# EasyEDA schematic Percepção_Térmica.json
TITLE: Potentiometer controller circuit; REV: 1.0; Date: 2020-03-27; Sheet: 1/1; Drawn By: bruna_eletronjun; Company: EletronJun
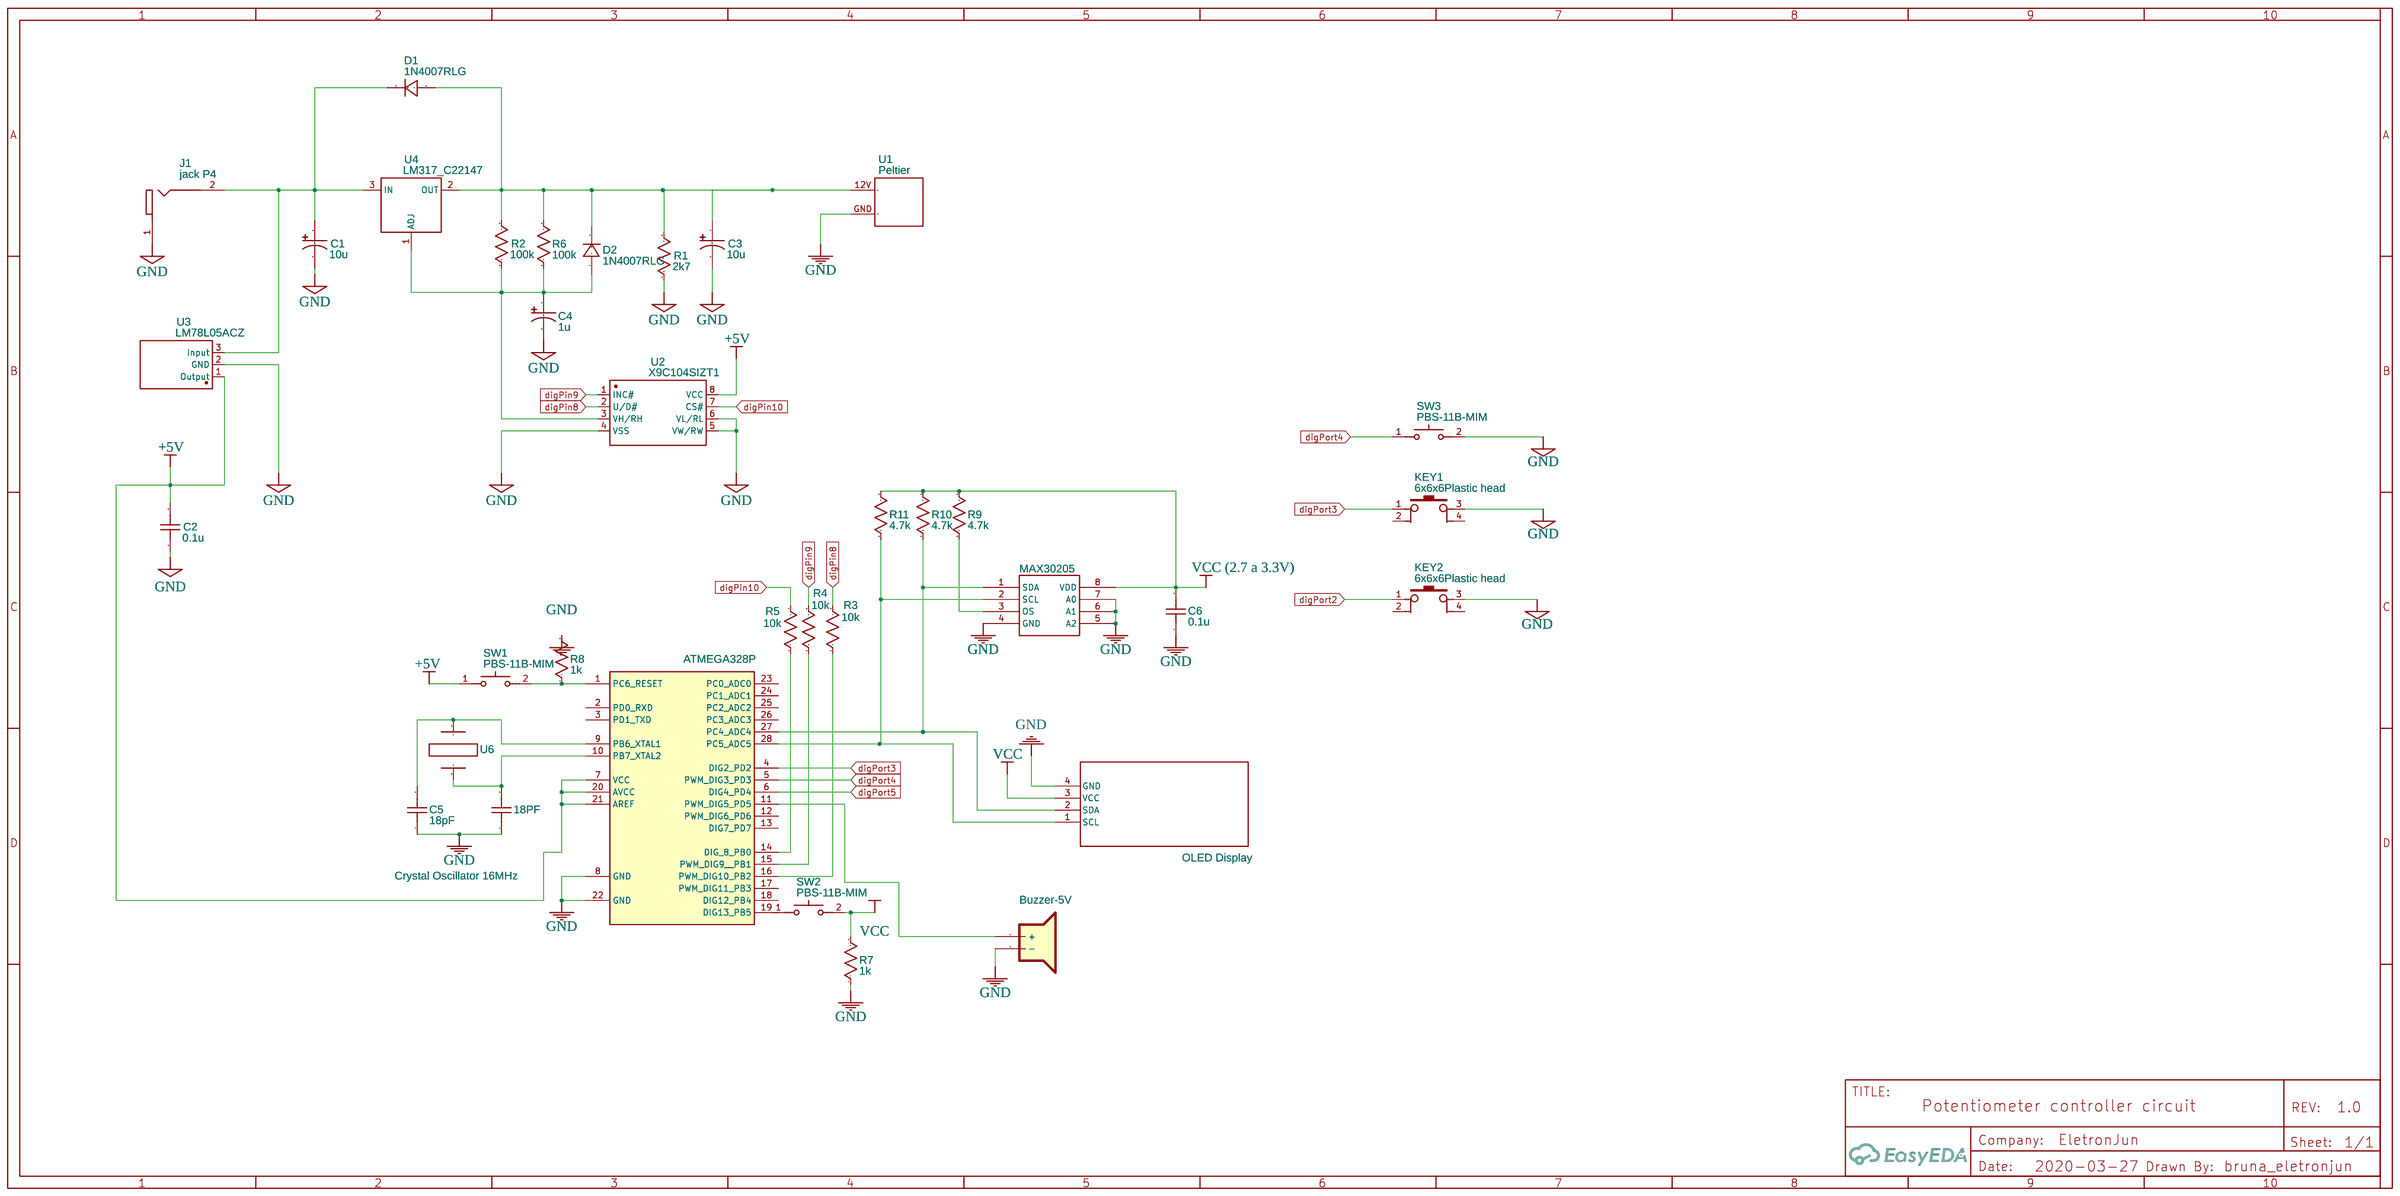
[diagram p0: schematic sheet]

## Parts
18PF  1u  [RAD-0.1]
BZ1  Buzzer-5V  [BUZZER-5V]
C1  10u  [CAP-D3.0XF1.5]
C2  0.1u  [RAD-0.1]
C3  10u  [CAP-D3.0XF1.5]
C4  1u  [CAP-D3.0XF1.5]
C5  18pF  [RAD-0.1]
C6  0.1u  [RAD-0.1]
D1  1N4007RLG  [DO-41_BD2.4-L4.7-P8.70-D0.9-RD]
D2  1N4007RLG  [DO-41_BD2.4-L4.7-P8.70-D0.9-RD]
J1  jack P4  [2.1MM POWER JACK]
KEY1  6x6x6Plastic head  [KEY-6.0*6.0]
KEY2  6x6x6Plastic head  [KEY-6.0*6.0]
R1  2k7  [AXIAL-0.3]
R2  100k  [AXIAL-0.3]
R3  10k  [AXIAL-0.3]
R4  10k  [AXIAL-0.3]
R5  10k  [AXIAL-0.3]
R6  100k  [AXIAL-0.3]
R7  1k  [AXIAL-0.3]
R8  1k  [AXIAL-0.3]
R9  4.7k  [AXIAL-0.3]
R10  4.7k  [AXIAL-0.3]
R11  4.7k  [AXIAL-0.3]
SW1  PBS-11B-MIM  [PBS11B-MIN]
SW2  PBS-11B-MIM  [PBS11B-MIN]
SW3  PBS-11B-MIM  [PBS11B-MIN]
U1  Peltier  [PELTIER]
U2  X9C104SIZT1  [SOIC-8_L4.9-W3.9-P1.27-LS6.0-BL]
U3  LM78L05ACZ  [TO-92-3_L4.9-W3.7-P1.27-L]
U4  LM317_C22147  [TO-220-3_L10.0-W4.5-P2.54-L]
U6  Crystal Oscillator 16MHz  [SMD CRISTAL]
U7  ATMEGA328P  [DIP-28_300MIL]
U8  MAX30205
U9  OLED Display  [GROVE - OLED DISPLAY 1.12'']

## Library data of the parts
18PF C2 C5 C6 = Cap_RAD-0.1_US
BZ1 = -: Manufacturer: YEC; Manufacturer Part: M12G3; Supplier: ES; Supplier Part: 0237-0021-7; link: https://www.es.co.th/detail.asp?Prod=023700217; Contributor: wichai.sunkarat
C1 C3 C4 = Cap_Electrolytic(TH)_D3.0XF1.5_US
D1 D2 = 1N4007RLG: Supplier: LCSC; Manufacturer: ON; image: //image.lceda.cn/szlcsc/C53568.jpg; Supplier Part: C53568
J1 = jack P4: Contributor: Breno Lucas; sourceId: TZz9IiEeq; Manufacturer Part: RAPC722X; Manufacturer: Switchcraft; Supplier Part: 502-RAPC722X; Supplier: Mouser
KEY1 KEY2 = 6x6x6Plastic head: Supplier Part: C23550; Supplier: LCSC; Manufacturer: ReliaPro; image: http://image.lceda.cn/szlcsc/C23550.jpg
R1-R11 = Res_AXIAL-0.3(1/8W)_US
SW1-SW3 = -: Supplier: LCSC; Supplier Part: C202388; Manufacturer: ALPS Electric; Manufacturer Part: SKRKAHE020; Contributor: LCSC
U1 = Peltier: Contributor: Edurojolavanda
U2 = X9C104SIZT1: Supplier: LCSC; Manufacturer: Intersil; image: //image.lceda.cn/szlcsc/C11979.jpg; Supplier Part: C11979; LCSC Assembly: Yes; SMT Type: Extend
U3 = LM78L05ACZ: Supplier: LCSC; Supplier Part: C112082; Manufacturer: ON Semicon; Contributor: LCSC
U4 = LM317_C22147: Supplier: LCSC; Manufacturer: CJ; Manufacturer Part: LM317; Supplier Part: C22147; Contributor: 立创EDA官方封装库
U6 = -: Contributor: HESPzIroN
U7 = -: sourceId: Oic6oiASL; EasyEDA: C33901; Supplier Part: C33901; Supplier: EasyEDA; Manufacturer: ATMEL; Manufacturer Part: ATMEGA328P-PU
U8 = -: Contributor: muneeb1212
U9 = -: sourceId: X2WQ82kCU; Supplier Part: undefined; Supplier: SeeedStudio

## Nets
+5V: C2.2 SW1.1 U2.8(VCC) U3.1(Output) U7.7(VCC) U7.20(AVCC) U7.21(AREF)
GND: 18PF.1 BZ1.2(-) C1.2 C2.1 C3.2 C4.2 C5.1 C6.1 J1.1 KEY1.3 KEY2.3 R1.1 R7.1 R8.2 SW3.2 U1.GND(1) U2.4(VSS) U2.5(VW/RW) U2.6(VL/RL) U3.2(GND) U7.8(GND) U7.22(GND) U8.4(GND) U8.5(A2) U8.6(A1) U8.7(A0) U9.4(GND)
VCC: R7.2 SW2.2 U9.3(VCC)
VCC (2.7 a 3.3V): C6.2 R9.2 R10.2 R11.2 U8.8(VDD)
digPin8: R3.2 U2.2(U/D#)
digPin9: R4.2 U2.1(INC#)
digPin10: R5.2 U2.7(CS#)
digPort2: KEY2.1
digPort3: KEY1.1 U7.4(DIG2 PD2)
digPort4: SW3.1 U7.5(PWM DIG3 PD3)
digPort5: U7.6(DIG4 PD4)
Net-(18PF-2): 18PF.2 U6.2 U7.10(PB7 XTAL2)
Net-(BZ1-1): BZ1.1(+) U7.11(PWM DIG5 PD5)
Net-(C1-1): C1.1 D1.1(C) J1.2 U3.3(Input) U4.3(IN)
Net-(C3-1): C3.1 D1.2(A) D2.1(C) R1.2 R2.2 R6.2 U1.12V(2) U4.2(OUT)
Net-(C4-1): C4.1 D2.2(A) R2.1 R6.1 U2.3(VH/RH) U4.1(ADJ)
Net-(C5-2): C5.2 U6.1 U7.9(PB6 XTAL1)
Net-(R3-1): R3.1 U7.16(PWM DIG10 PB2)
Net-(R4-1): R4.1 U7.15(PWM DIG9  PB1)
Net-(R5-1): R5.1 U7.14(DIG 8 PB0)
Net-(R8-1): R8.1 SW1.2 U7.1(PC6 RESET)
Net-(R9-1): R9.1 U8.3(OS)
Net-(R10-1): R10.1 U7.27(PC4 ADC4) U8.1(SDA) U9.2(SDA)
Net-(R11-1): R11.1 U7.28(PC5 ADC5) U8.2(SCL) U9.1(SCL)

Not connected (* = marked no-connect by the designer): KEY1 2 4; KEY2 2 4; SW2 1; U7 2(PD0 RXD) 3(PD1 TXD) 12(PWM DIG6 PD6) 13(DIG7 PD7) 17(PWM DIG11 PB3) 18(DIG12 PB4) 19(DIG13 PB5) 23(PC0 ADC0) 24(PC1 ADC1) 25(PC2 ADC2) 26(PC3 ADC3)
